# EAGLE schematic 8-electrovalvulas_V3 (EAGLE 6.4)
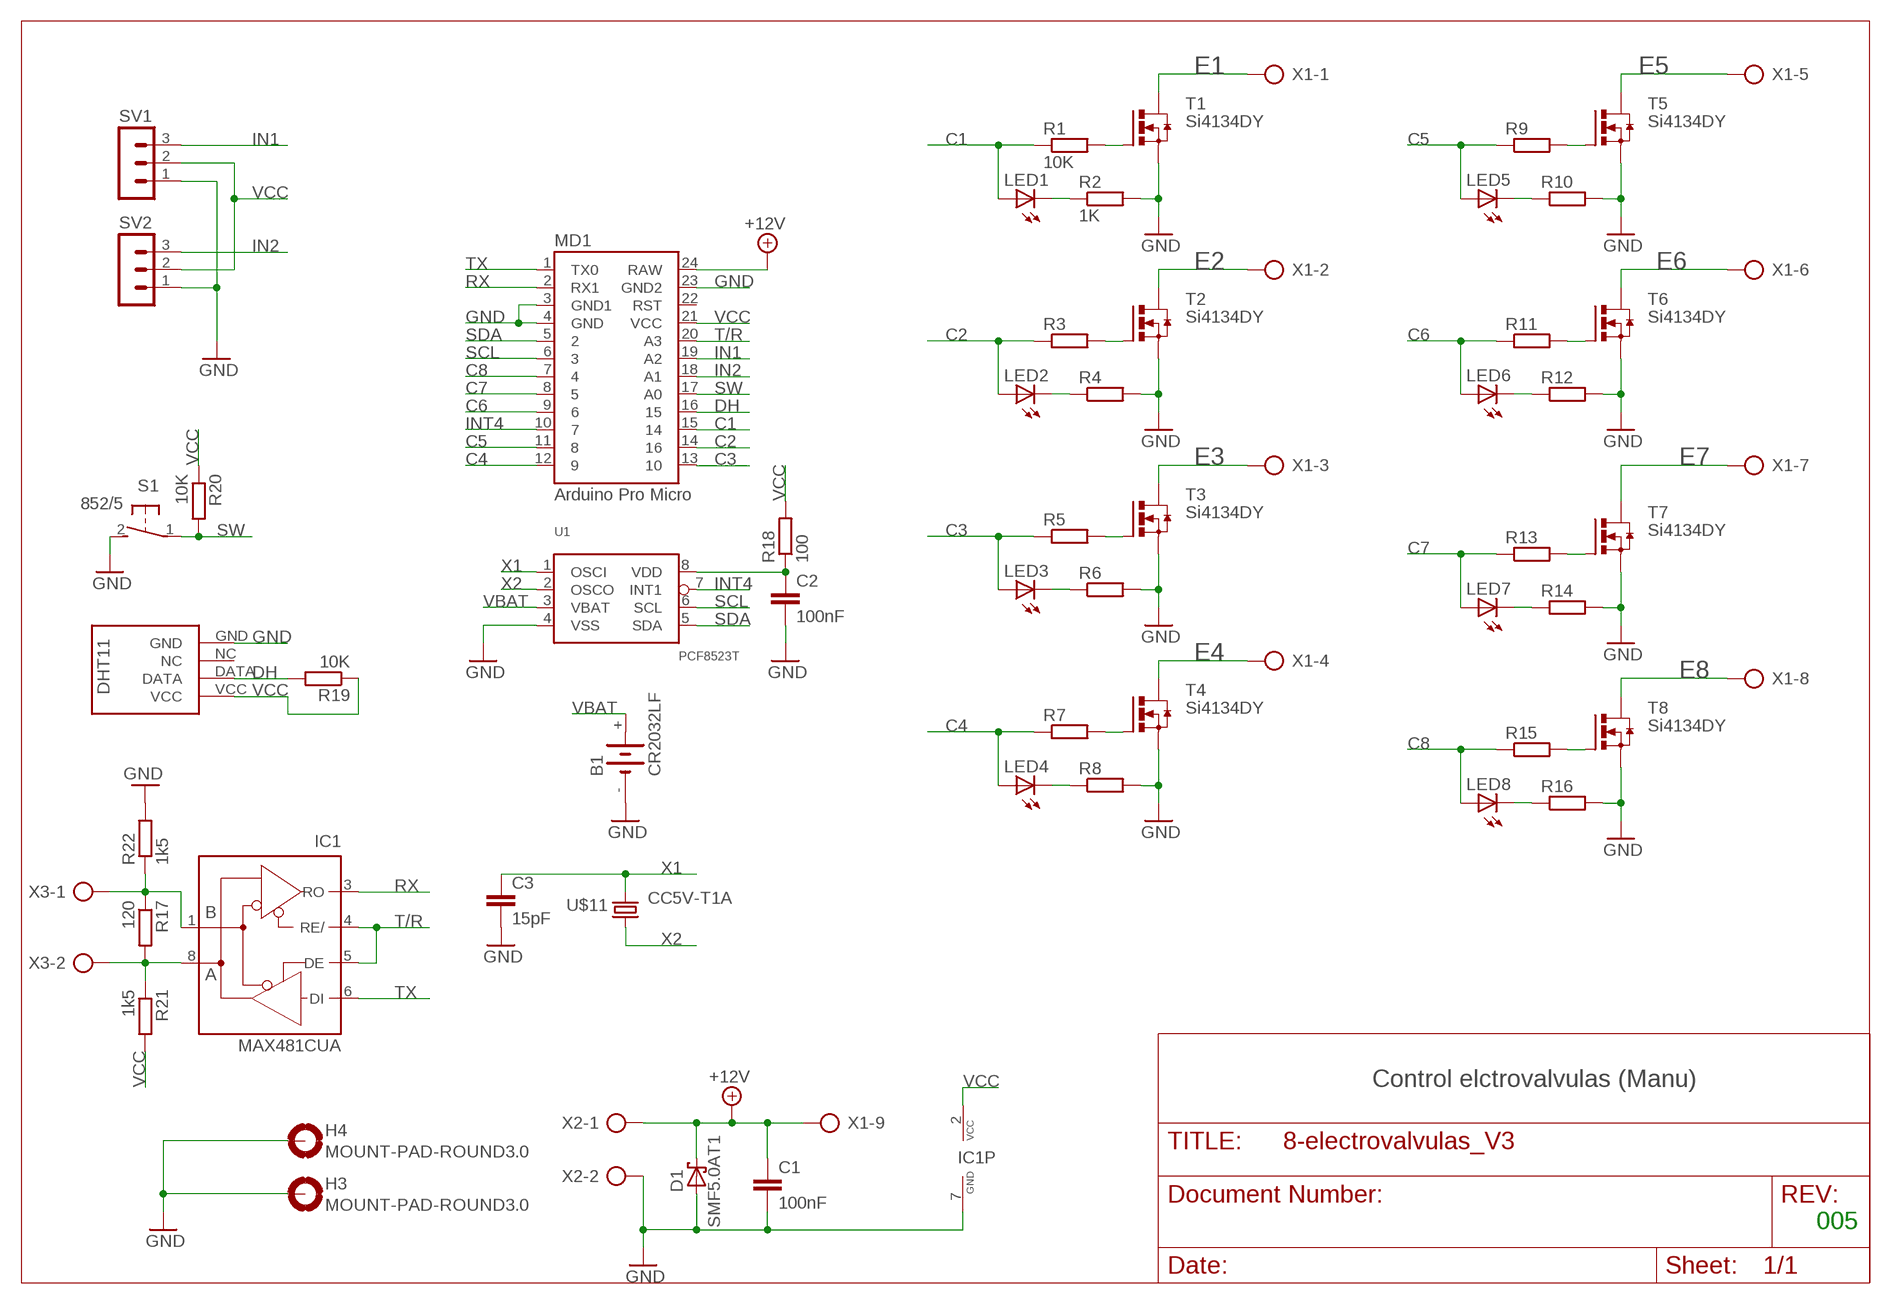
[diagram p0: schematic, sheet 1]

## Parts
B1  CR2032LF  BATTERY_2032LF  [BATTERY_1236_C]
C1  100nF  C-EUC1206  [C1206]
C2  100nF  C-EUC0603  [C0603]
C3  15pF  C-EUC0603  [C0603]
D1  SMF5.0AT1  [SOD123FL]
H3  MOUNT-PAD-ROUND3.0  [3,0-PAD]
H4  MOUNT-PAD-ROUND3.0  [3,0-PAD]
IC1  MAX481CUA  [UMAX8]
IC10  DHT11-PION.  [DHT11-PION.]
LED1  LEDSML0805  [SML0805]
LED2  LEDSML0805  [SML0805]
LED3  LEDSML0805  [SML0805]
LED4  LEDSML0805  [SML0805]
LED5  LEDSML0805  [SML0805]
LED6  LEDSML0805  [SML0805]
LED7  LEDSML0805  [SML0805]
LED8  LEDSML0805  [SML0805]
MD1  Arduino Pro Micro  PRO_MICRO  [PRO_MICRO]
R1  10K  R-EU_R0603  [R0603]
R2  1K  R-EU_R0603  [R0603]
R3  R-EU_R0603  [R0603]
R4  R-EU_R0603  [R0603]
R5  R-EU_R0603  [R0603]
R6  R-EU_R0603  [R0603]
R7  R-EU_R0603  [R0603]
R8  R-EU_R0603  [R0603]
R9  R-EU_R0603  [R0603]
R10  R-EU_R0603  [R0603]
R11  R-EU_R0603  [R0603]
R12  R-EU_R0603  [R0603]
R13  R-EU_R0603  [R0603]
R14  R-EU_R0603  [R0603]
R15  R-EU_R0603  [R0603]
R16  R-EU_R0603  [R0603]
R17  120  R-EU_R0603  [R0603]
R18  100  R-EU_R0603  [R0603]
R19  10K  R-EU_R0603  [R0603]
R20  10K  R-EU_R0603  [R0603]
R21  1k5  R-EU_R0603  [R0603]
R22  1k5  R-EU_R0603  [R0603]
S1  852/5  31-XX  [B3F-31XX]
SV1  MA03-1  [MA03-1]
SV2  MA03-1  [MA03-1]
T1  Si4134DY  SI4134DY  [SO-08]
T2  Si4134DY  SI4134DY  [SO-08]
T3  Si4134DY  SI4134DY  [SO-08]
T4  Si4134DY  SI4134DY  [SO-08]
T5  Si4134DY  SI4134DY  [SO-08]
T6  Si4134DY  SI4134DY  [SO-08]
T7  Si4134DY  SI4134DY  [SO-08]
T8  Si4134DY  SI4134DY  [SO-08]
U1  PCF8523T  [SOT96-1]
U$11  CC5V-T1A  [T1A]
X1  AK300/9  [AK300/9]
X2  AK300/2  [AK300/2]
X3  AK300/2  [AK300/2]

## Nets
+12V: C1.1 D1.C MD1.24(RAW) X1.9 X2.1
A: IC1.8(A) R17.2 R21.1 X3.2
B: IC1.1(B) R17.1 R22.1 X3.1
C1: LED1.A MD1.15 R1.1
C2: LED2.A MD1.14 R3.1
C3: LED3.A MD1.13 R5.1
C4: LED4.A MD1.12 R7.1
C5: LED5.A MD1.11 R9.1
C6: LED6.A MD1.9 R11.1
C7: LED7.A MD1.8 R13.1
C8: LED8.A MD1.7 R15.1
DH: IC10.DATA MD1.16 R19.2
E1: T1.5(D) T1.6(D) T1.7(D) T1.8(D) X1.1
E2: T2.5(D) T2.6(D) T2.7(D) T2.8(D) X1.2
E3: T3.5(D) T3.6(D) T3.7(D) T3.8(D) X1.3
E4: T4.5(D) T4.6(D) T4.7(D) T4.8(D) X1.4
E5: T5.5(D) T5.6(D) T5.7(D) T5.8(D) X1.5
E6: T6.5(D) T6.6(D) T6.7(D) T6.8(D) X1.6
E7: T7.5(D) T7.6(D) T7.7(D) T7.8(D) X1.7
E8: T8.5(D) T8.6(D) T8.7(D) T8.8(D) X1.8
GND: B1.- C1.2 C2.2 C3.2 D1.A H3.B3,0(MOUNT) H4.B3,0(MOUNT) IC1.7(GND) IC10.GND MD1.3(GND1) MD1.4(GND) MD1.23(GND2) R2.2 R4.2 R6.2 R8.2 R10.2 R12.2 R14.2 R16.2 R22.2 S1.2(S) SV1.1 SV2.1 T1.1(S) T1.2(S) T1.3(S) T2.1(S) T2.2(S) T2.3(S) T3.1(S) T3.2(S) T3.3(S) T4.1(S) T4.2(S) T4.3(S) T5.1(S) T5.2(S) T5.3(S) T6.1(S) T6.2(S) T6.3(S) T7.1(S) T7.2(S) T7.3(S) T8.1(S) T8.2(S) T8.3(S) U1.4(VSS) X2.2
IN1: MD1.19(A2) SV1.3
IN2: MD1.18(A1) SV2.3
INT4: MD1.10 U1.7(INT1)
N$1: R1.2 T1.4(G)
N$3: LED1.C R2.1
N$5: R3.2 T2.4(G)
N$6: C2.1 R18.1 U1.8(VDD)
N$7: LED2.C R4.1
N$8: R5.2 T3.4(G)
N$10: LED3.C R6.1
N$11: R7.2 T4.4(G)
N$12: R9.2 T5.4(G)
N$13: LED4.C R8.1
N$15: LED5.C R10.1
N$16: R11.2 T6.4(G)
N$18: LED6.C R12.1
N$19: R13.2 T7.4(G)
N$21: LED7.C R14.1
N$22: R15.2 T8.4(G)
N$24: LED8.C R16.1
RX: IC1.3(RO) MD1.2(RX1)
SCL: MD1.6 U1.6(SCL)
SDA: MD1.5 U1.5(SDA)
SW: MD1.17(A0) R20.2 S1.1(P)
T/R: IC1.4(RE/) IC1.5(DE) MD1.20(A3)
TX: IC1.6(DI) MD1.1(TX0)
VBAT: B1.+ U1.3(VBAT)
VCC: IC1.2(VCC) IC10.VCC MD1.21(VCC) R18.2 R19.1 R20.1 R21.2 SV1.2 SV2.2
X1: C3.1 U1.1(OSCI) U$11.2
X2: U1.2(OSCO) U$11.1
Unconnected: IC10.NC MD1.22(RST)

## Notes on the sheet
- Control elctrovalvulas (Manu)
- 005

## Library data of the parts
B1 = Itead_BP_110825.lbr:BATTERY_2032LF
C1-C3 = rcl:C-EU: CAPACITOR, European symbol
D1 = diode:SMF5.0AT1: 200 W Transient Voltage Suppressor Source: Data sheet <http://www.onsemi.com/pub_link/Collateral/SMF5.0AT1-D.PDF>
H3 H4 = holes:MOUNT-PAD-ROUND: MOUNTING PAD, round
IC1 = maxim:MAX481CUA: RS485 TRANSEIVER; MPN: MAX481CUA+; OC_FARNELL: unknown; OC_NEWARK: 71P2381
IC10 = DHT11:DHT11-PION.: DHT11 Czujnik temperatury i wilgotności (widok pionowy)
LED1-LED8 = led:LED: LED OSRAM: - CHIPLED LG R971, LG N971, LY N971, LG Q971, LY Q971, LO R971, LY R971 LH N974, LH R974 LS Q976, LO Q976, LY Q976 LO Q996 - Hyper CHIPLED LW Q18S LB Q993, LB Q99A, LB R99A - SideLED LS A670, LO A670, LY A670, LG A670, LP A670 LB A673, LV A673, LT A673, LW A673 LH A674 LY A675 LS A676, LA A676, LO A676, LY A676, LW A676 LS A679, LY A679, LG A679 - Hyper Micro SIDELED® LS Y876, LA Y876, LO Y876, LY Y876 LT Y87S - SmartLED LW L88C, LW L88S LB L89C, LB L89S, LG L890 LS L89K, LO L89K, LY L89K LS L896, LA L896, LO L896, LY L896 - TOPLED LS T670, LO T670, LY T670, LG T670, LP T670 LSG T670, LSP T670, LSY T670, LOP T670, LYG T670 LG T671, LOG T671, LSG T671 LB T673, LV T673, LT T673, LW T673 LH T674 LS T676, LA T676, LO T676, LY T676, LB T676, LH T676, LSB T676, LW T676 LB T67C, LV T67C, LT T67C, LS T67K, LO T67K, LY T67K, LW E67C LS E67B, LA E67B, LO E67B, LY E67B, LB E67C, LV E67C, LT E67C LW T67C LS T679, LY T679, LG T679 LS T770, LO T770, LY T770, LG T770, LP T770 LB T773, LV T773, LT T773, LW T773 LH T774 LS E675, LA E675, LY E675, LS T675 LS T776, LA T776, LO T776, LY T776, LB T776 LHGB T686 LT T68C, LB T68C - Hyper Mini TOPLED® LB M676 - Mini TOPLED Santana® LG M470 LS M47K, LO M47K, LY M47K Source: http://www.osram.convergy.de LUXEON: - LUMILED® LXK2-PW12-R00, LXK2-PW12-S00, LXK2-PW14-U00, LXK2-PW14-V00 LXK2-PM12-R00, LXK2-PM12-S00, LXK2-PM14-U00 LXK2-PE12-Q00, LXK2-PE12-R00, LXK2-PE12-S00, LXK2-PE14-T00, LXK2-PE14-U00 LXK2-PB12-K00, LXK2-PB12-L00, LXK2-PB12-M00, LXK2-PB14-N00, LXK2-PB14-P00, LXK2-PB14-Q00 LXK2-PR12-L00, LXK2-PR12-M00, LXK2-PR14-Q00, LXK2-PR14-R00 LXK2-PD12-Q00, LXK2-PD12-R00, LXK2-PD12-S00 LXK2-PH12-R00, LXK2-PH12-S00 LXK2-PL12-P00, LXK2-PL12-Q00, LXK2-PL12-R00 Source: www.luxeon.com KINGBRIGHT: KA-3528ASYC Source: www.kingbright.com
MD1 = Arduino_pro_micro:PRO_MICRO
R1-R22 = rcl:R-EU_: RESISTOR, European symbol
S1 = adafruit:31-XX: OMRON SWITCH Now with beefier pads!
SV1 SV2 = con-lstb:MA03-1: PIN HEADER; OC_FARNELL: unknown; OC_NEWARK: unknown
T1-T8 = transistor-power:SI4134DY
U1 = nxp_60_1_1:PCF8523: The PCF8523 is a CMOS Real-Time Clock (RTC) and calendar optimized for low power consumption. Data is transferred serially via an I2C-bus with a maximum data rate of 1000 kbit/s. Alarm and timer functions are available with the possibility to generate a wake-up signal on an interrupt pin. An offset register allows fine-tuning of the clock. The PCF8523 has a backup battery switch-over circuit, which detects power failures and automatically switches to the battery supply when a power failure occurs. AAL Eindhoven MK
U$11 = crystal:CC5V-T1A
X1 = con-ptr500:AK300/9: CONNECTOR; OC_FARNELL: unknown; OC_NEWARK: unknown
X2 X3 = con-ptr500:AK300/2: CONNECTOR; OC_FARNELL: unknown; OC_NEWARK: unknown